# Altium project V2.5.0_ChipSat.PrjPcb
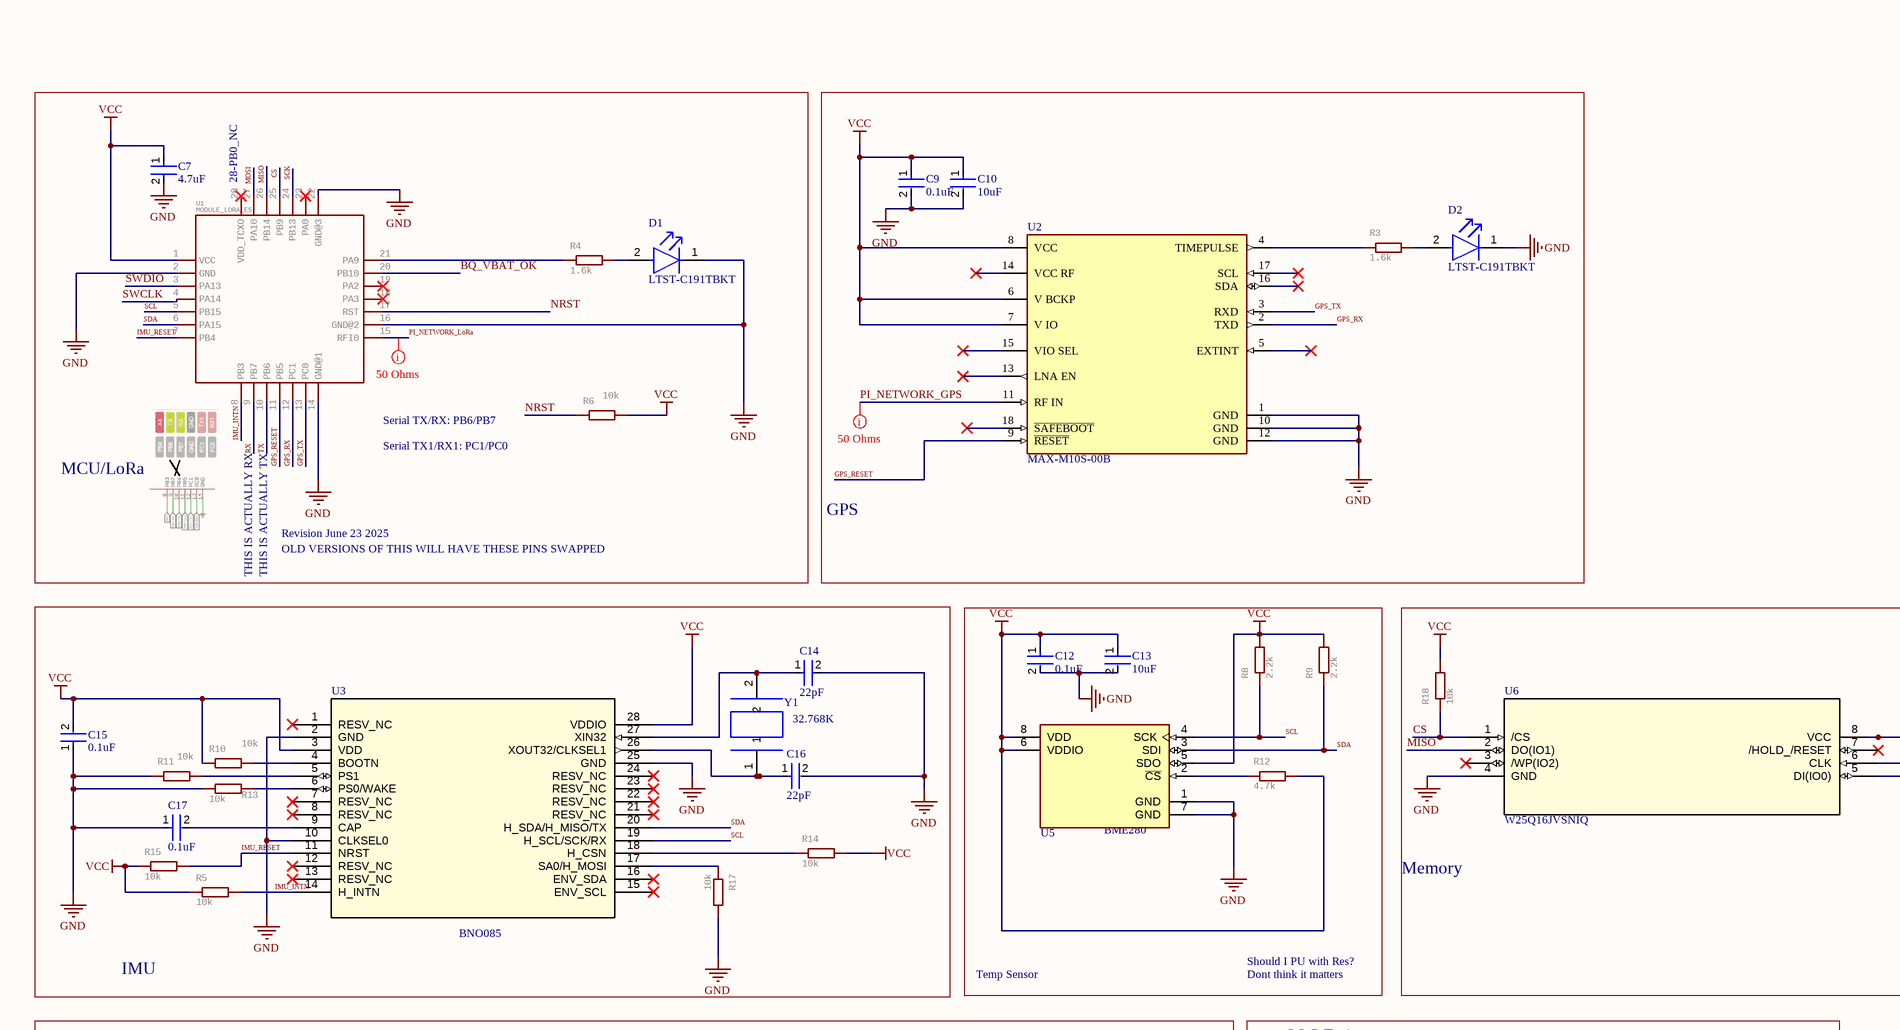
[diagram p0: V2.5.0_ChipSat.SchDoc, top left]
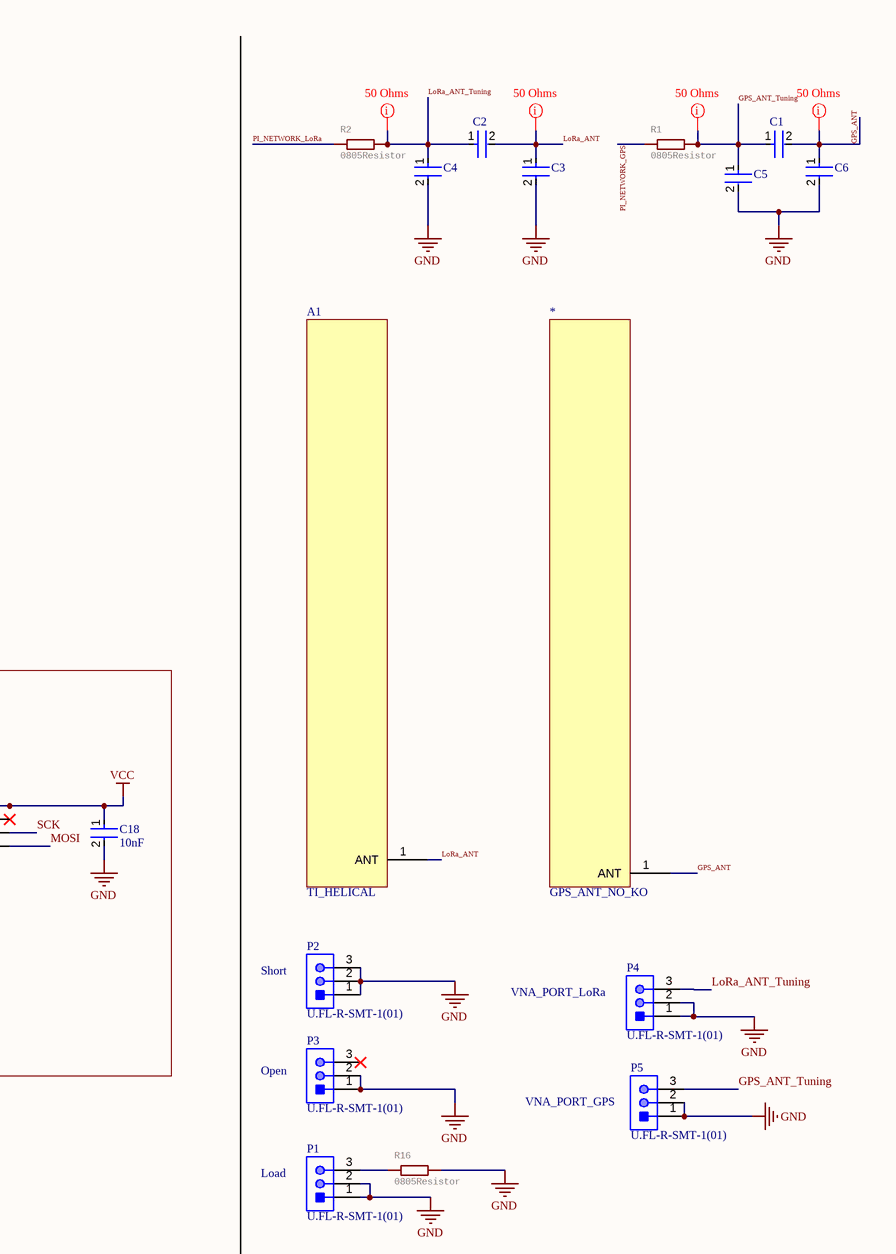
[diagram p1: V2.5.0_ChipSat.SchDoc, top right]
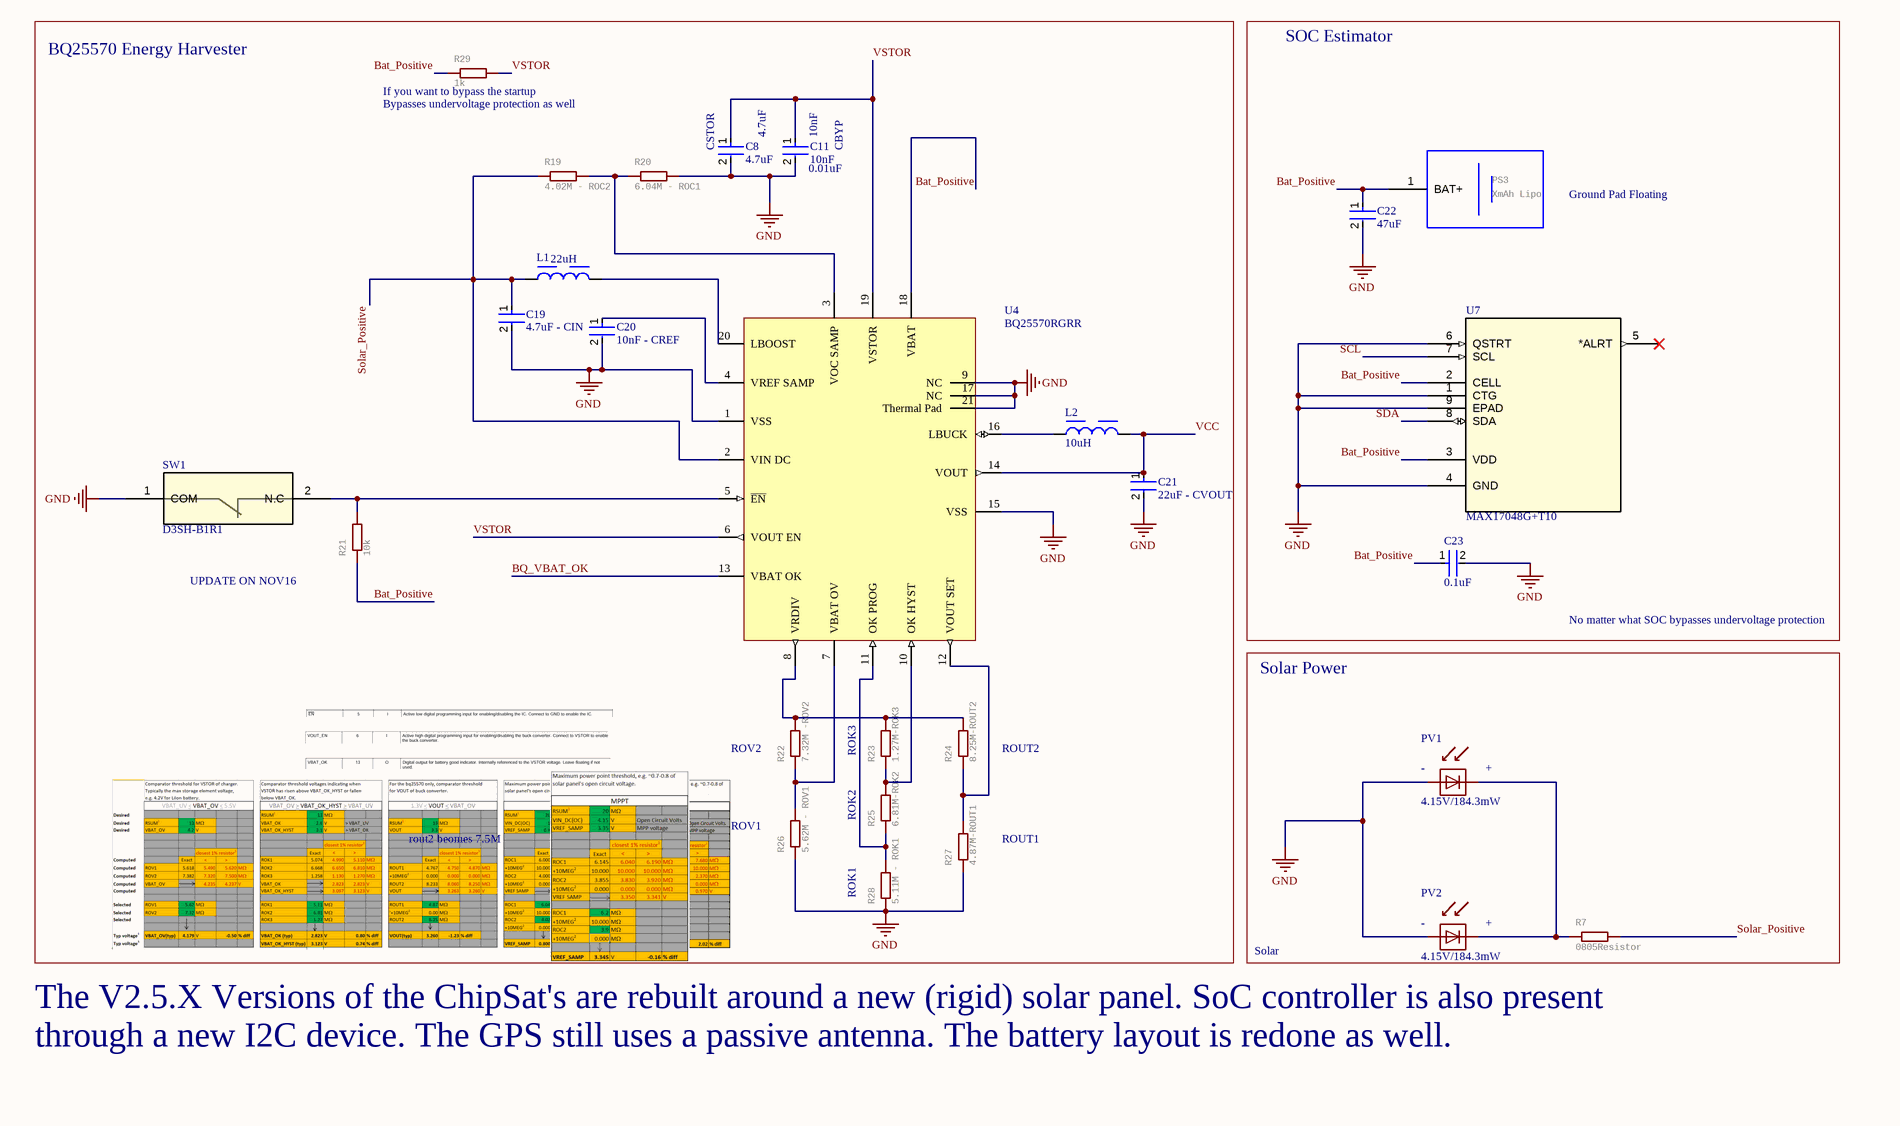
[diagram p2: V2.5.0_ChipSat.SchDoc, bottom left]
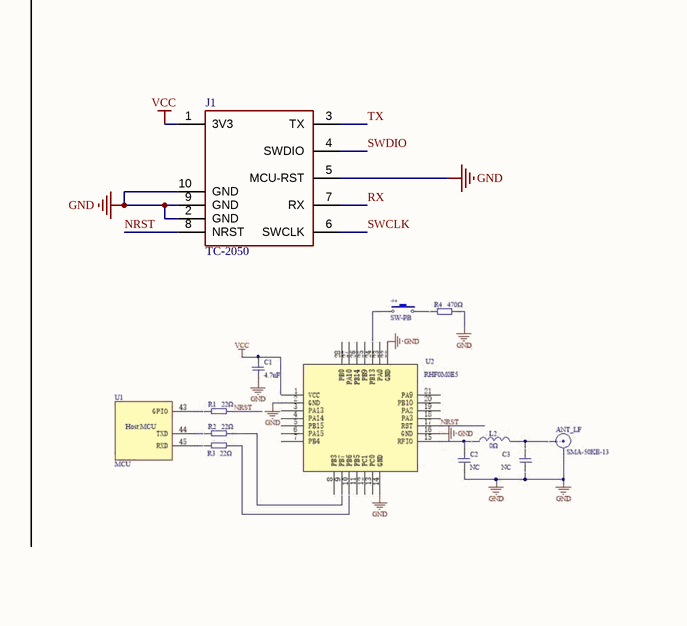
[diagram p3: V2.5.0_ChipSat.SchDoc, bottom right]
1 sheet, 76 parts. Net scope: global (net labels, ports and power ports of the same name join across sheets).
Board file: V2.5.0_ChipSat.PcbDoc

## Sheet V2.5.0_ChipSat.SchDoc
size 558 x 431 mm; SheetNumber: 1; SheetTotal: 1

### Parts
*  GPS_ANT_NO_KO  [GPS_ANT_NO_KO]
A1  TI_HELICAL  [TI_HELICAL]
C1  C0402C223K8PACTU  [PI_NET_CAPACITOR_0805]  (value not drawn)
C2  C0402C223K8PACTU  [PI_NET_CAPACITOR_0805]  (value not drawn)
C3  C0402C223K8PACTU  [PI_NET_CAPACITOR_0805]  (value not drawn)
C4  C0402C223K8PACTU  [PI_NET_CAPACITOR_0805]  (value not drawn)
C5  C0402C223K8PACTU  [PI_NET_CAPACITOR_0805]  (value not drawn)
C6  C0402C223K8PACTU  [PI_NET_CAPACITOR_0805]  (value not drawn)
C7  4.7uF  [0402CAP]
C8  4.7uF  [0402CAP]
C9  0.1uF  [0402CAP]
C10  10uF  [0402CAP]
C11  10nF  [0402CAP]
C12  0.1uF  [0402CAP]
C13  10uF  [0402CAP]
C14  22pF  [0402CAP]
C15  0.1uF  [0402CAP]
C16  22pF  [0402CAP]
C17  0.1uF  [0402CAP]
C18  10nF  [0402CAP]
C19  4.7uF - CIN  [0402CAP]
C20  10nF - CREF  [0402CAP]
C21  22uF - CVOUT  [0402CAP]
C22  47uF  [0805Cap]
C23  0.1uF  [0402CAP]
D1  LTST-C191TBKT  [0805LED]
D2  LTST-C191TBKT  [0805LED]
J1  TC-2050  [JTAG_10p_SilkLess]
L1  22uH  [Inductor_Boost_BQ25570]
L2  10uH  [Inductor_Buck_BQ25570]
P1  U.FL-R-SMT-1(01)  [UFL]
P2  U.FL-R-SMT-1(01)  [UFL]
P3  U.FL-R-SMT-1(01)  [UFL]
P4  U.FL-R-SMT-1(01)  [UFL]
P5  U.FL-R-SMT-1(01)  [UFL]
PS3  XmAh Lipo  [Single_Bat_Pad]
PV1  4.15V/184.3mW  [SolarPanel_KXOB141K06TF-TR]
PV2  4.15V/184.3mW  [SolarPanel_KXOB141K06TF-TR]
R1  0805Resistor  [0805Res]
R2  0805Resistor  [0805Res]
R3  1.6k  [0805Res]
R4  1.6k  [0805Res]
R5  10k  [0402]
R6  10k  [0402]
R7  0805Resistor  [0805Res]
R8  2.2k  [0402]
R9  2.2k  [0402]
R10  10k  [0402]
R11  10k  [0402]
R12  4.7k  [0402]
R13  10k  [0402]
R14  10k  [0402]
R15  10k  [0402]
R16  0805Resistor  [0805Res]
R17  10k  [0402]
R18  10k  [0402]
R19  4.02M - ROC2  [0402]
R20  6.04M - ROC1  [0402]
R21  10k  [0402]
R22  7.32M -ROV2  [0402]
R23  1.27M-ROK3  [0402]
R24  8.25M-ROUT2  [0402]
R25  6.81M-ROK2  [0402]
R26  5.62M - ROV1  [0402]
R27  4.87M-ROUT1  [0402]
R28  5.11M - ROK1  [0402]
R29  1k  [0402]
SW1  D3SH-B1R1  [Micro_Trigger_Switch_Long_D3SH-B1R1]
U1  MODULE_LORA_E5  [MODULE28P-1-25-12X12X2-5MM]
U2  MAX-M10S-00B  [GPS_MAX_10]
U3  BNO085  [QFN28_BNO086_CEV]
U4  BQ25570RGRR  [BQ25570_With_Vias]
U5  BME280  [FP-BME280-MFG]  (value not drawn)
U6  W25Q16JVSNIQ  [SOIC_150MIL_WIN]
U7  MAX17048G+T10  [MAX17048G+T10]
Y1  32.768K  [IMU_CLK_XTAL320X150X75]

### Blocks framed on the sheet
MCU/LoRa: C7 D1 R4 R6 U1
GPS: C9 C10 D2 R3 U2
IMU: C14-C17 R5 R10 R11 R13-R15 R17 U3 Y1
Memory: C18 R18 U6
BQ25570 Energy Harvester: C8 C11 C19-C21 L1 L2 R19-R29 SW1 U4
SOC Estimator: C22 C23 PS3 U7
Solar Power: PV1 PV2 R7

### Nets
GND: C3.2 C4.2 C5.2 C6.2 C7.2 C8.2 C9.2 C10.2 C11.2 C12.2 C13.2 C14.2 C15.1 C16.2 C17.1 C18.2 C19.2 C20.2 C21.2 C22.2 C23.2 D1.1(C) D2.1(C) J1.2(GND) J1.5(MCU-RST) J1.9(GND) J1.10(GND) P1.1 P1.2 P2.1 P2.2 P2.3 P3.1 P3.2 P4.1 P4.2 P5.1 P5.2 PV1.2(-) PV2.2(-) R11.1 R13.1 R16.2 R17.2 R20.2 R26.1 R27.1 R28.1 SW1.1(COM) U1.2(GND) U1.14(GND@1) U1.16(GND@2) U1.22(GND@3) U2.1(GND) U2.10(GND) U2.12(GND) U3.2(GND) U3.10(CLKSEL0) U3.25(GND) U4.1(VSS) U4.9(NC) U4.15(VSS) U4.17(NC) U4.21(Thermal_Pad) U5.1(GND) U5.7(GND) U6.4(GND) U7.1(CTG) U7.4(GND) U7.6(QSTRT) U7.9(EPAD)
VCC: C7.1 C9.1 C10.1 C12.1 C13.1 C15.2 C18.1 C21.1 J1.1(3V3) L2.2 R5.1 R6.2 R8.2 R9.2 R10.1 R12.2 R14.2 R15.1 R18.2 U1.1(VCC) U2.6(V_BCKP) U2.7(V_IO) U2.8(VCC) U3.3(VDD) U3.28(VDDIO) U4.14(VOUT) U5.5(SDO) U5.6(VDDIO) U5.8(VDD) U6.8(VCC)
Bat_Positive: C22.1 C23.1 PS3.1(BAT+) R21.1 R29.1 U4.18(VBAT) U7.2(CELL) U7.3(VDD)
BQ_VBAT_OK: U1.20(PB10) U4.13(VBAT_OK)
CS: R18.1 U1.25(PB9) U6.1(/CS)
GPS_ANT: *.1(ANT) C1.2 C6.1
GPS_ANT_Tuning: C1.1 C5.1 P5.3 R1.2
GPS_RESET: U1.11(PB5) U2.9(~{RESET})
GPS_RX: U1.12(PC1) U2.2(TXD)
GPS_TX: U1.13(PC0) U2.3(RXD)
IMU_INTN: R5.2 U1.8(PB3) U3.14(H_INTN)
IMU_RESET: R15.2 U1.7(PB4) U3.11(NRST)
LoRa_ANT: A1.1(ANT) C2.2 C3.1
LoRa_ANT_Tuning: C2.1 C4.1 P4.3 R2.2
MISO: U1.26(PB14) U6.2(DO(IO1))
MOSI: U1.27(PA10) U6.5(DI(IO0))
NRST: J1.8(NRST) R6.1 U1.17(RST)
PI_NETWORK_GPS: R1.1 U2.11(RF_IN)
PI_NETWORK_LoRa: R2.1 U1.15(RFI0)
RX: J1.7(RX) U1.9(PB7)
SCK: U1.24(PB13) U6.6(CLK)
SCL: R8.1 U1.5(PB15) U3.19(H_SCL/SCK/RX) U5.4(SCK) U7.7(SCL)
SDA: R9.1 U1.6(PA15) U3.20(H_SDA/H_MISO/TX) U5.3(SDI) U7.8(SDA)
Solar_Positive: C19.1 L1.1 R7.2 R19.1 U4.2(VIN_DC)
SWCLK: J1.6(SWCLK) U1.4(PA14)
SWDIO: J1.4(SWDIO) U1.3(PA13)
TX: J1.3(TX) U1.10(PB6)
VSTOR: C8.1 C11.1 R29.2 U4.6(VOUT_EN) U4.19(VSTOR)
NetC14_1: C14.1 U3.27(XIN32) Y1.2
NetC16_1: C16.1 U3.26(XOUT32/CLKSEL1) Y1.1
NetC17_2: C17.2 U3.9(CAP)
NetC20_1: C20.1 U4.4(VREF_SAMP)
NetD1_2: D1.2(A) R4.2
NetD2_2: D2.2(A) R3.2
NetL1_2: L1.2 U4.20(LBOOST)
NetL2_1: L2.1 U4.16(LBUCK)
NetP1_3: P1.3 R16.1
NetPV1_1: PV1.1(+) PV2.1(+) R7.1
NetR3_1: R3.1 U2.4(TIMEPULSE)
NetR4_1: R4.1 U1.21(PA9)
NetR10_2: R10.2 U3.4(BOOTN)
NetR11_2: R11.2 U3.5(PS1)
NetR12_1: R12.1 U5.2(~{CS})
NetR13_2: R13.2 U3.6(PS0/WAKE)
NetR14_1: R14.1 U3.18(H_CSN)
NetR17_1: R17.1 U3.17(SA0/H_MOSI)
NetR19_2: R19.2 R20.1 U4.3(VOC_SAMP)
NetR21_2: R21.2 SW1.2(N.C) U4.5(~{EN})
NetR22_1: R22.1 R26.2 U4.7(VBAT_OV)
NetR22_2: R22.2 R23.2 R24.2 U4.8(VRDIV)
NetR23_1: R23.1 R25.2 U4.10(OK_HYST)
NetR24_1: R24.1 R27.2 U4.12(VOUT_SET)
NetR25_1: R25.1 R28.2 U4.11(OK_PROG)

Not connected (* = marked no-connect by the designer): P3 3*; U1 18(PA3)* 19(PA2)* 23(PA0)* 28(VDD_TCXO)*; U2 5(EXTINT)* 13(LNA_EN)* 14(VCC_RF)* 15(VIO_SEL)* 16(SDA)* 17(SCL)* 18(~{SAFEBOOT})*; U3 1(RESV_NC)* 7(RESV_NC)* 8(RESV_NC)* 12(RESV_NC)* 13(RESV_NC)* 15(ENV_SCL)* 16(ENV_SDA)* 21(RESV_NC)* 22(RESV_NC)* 23(RESV_NC)* 24(RESV_NC)*; U6 3(/WP(IO2))* 7(/HOLD_/RESET)*; U7 5(*ALRT)*

### Layout directives
rule Impedance Constraint [Min = 49.00    Max = 51.00    ]: GPS_ANT, GPS_ANT_Tuning, LoRa_ANT, LoRa_ANT_Tuning, PI_NETWORK_GPS, PI_NETWORK_LoRa

### Notes on the sheet
- (near U1) 28-PB0_NC
- (near U1) Serial TX/RX: PB6/PB7
- Serial TX1/RX1: PC1/PC0
- OLD VERSIONS OF THIS WILL HAVE THESE PINS SWAPPED
- Revision June 23 2025
- THIS IS ACTUALLY RX
- THIS IS ACTUALLY TX
- (near U5) BME280
- (near P2) Short
- VNA_PORT_LoRa
- Temp Sensor
- Should I PU with Res?
- Dont think it matters
- (near P3) Open
- VNA_PORT_GPS
- (near R29) If you want to bypass the startup
- (near R29) Bypasses undervoltage protection as well
- (near C8) CSTOR
- 4.7uF
- (near C11) 10nF
- (near C11) CBYP
- (near P1) Load
- (near C11) 0.01uF
- Ground Pad Floating
- UPDATE ON NOV16
- No matter what SOC bypasses undervoltage protection
- (near R22) ROV2
- (near R23) ROK3
- (near R24) ROUT2
- rout2 beomes 7.5M
- (near R26) ROV1
- (near R25) ROK2
- (near R27) ROUT1
- (near R28) ROK1
- Solar
- The V2.5.X Versions of the ChipSat's are rebuilt around a new (rigid) solar panel. SoC controller is also present through a new I2C device. The GPS still uses a passive antenna. The battery layout is redone as well.
- DWG. NO.
- REV.
- SHT.
- REVISION
- DESCRIPTION
- DATE
- APPROVED
- THIS DOCUMENT AND THE DATA DISCLOSED HEREIN OR HEREWITH IS THE PROPERTY OF ALTIUM LIMITED AND MAY BE FREELY DISTRIBUTED IN WHOLE. NO RIGHTS ARE RESERVED OR EXPRESS OR IMPLIED WARANTEE GIVEN.
- ENG:
- DSN:
- APPROVALS
- PROJECT
- DOCUMENT REVISION:
- DESIGN ITEM:
- CHK:
- BOM:
- REFERENCE DOCUMENTS
- PROJECT REVISION:
- TITLE
- FAB DWG:
- PCB DWG:
- ASSY DWG:
- SCALE:
- SIZE
- C
- CAGE CODE
- FILE NAME
- DWG NO.
- SHEET
- OF
- REV

### Library data of the parts
* = GPS_ANT_NO_KO: helical_antenna schematic for the DeSCENT v1 ChipSat
A1 = TI_HELICAL: helical_antenna schematic for the DeSCENT v1 ChipSat
C1-C6 = 0805RFCapacitor_NO_SILK: CAP0805; Manufacturer: Kemet; Capacitance: 22,000 pF; Value: 22,000 pF; Temperature Coefficient: 15%; Material: Ceramic; Voltage Rating: 10 V; Temperature Characteristic: X5R; Tolerance: 0.1; RoHS: TRUE; Octopart: https://octopart.com/c0402c223k8pactu-kemet-140074; Category: Cap; Manufacturer Part Number: C0402C223K8PACTU; Lead Free: Yes; Automotive: No; Height: 0.55mm; Ipc Land Pattern Name: CAPC10050X50; ComponentLink2URL: https://content.kemet.com/datasheets/KEM_C1002_X7R_SMD.pdf; Device Class L2: Capacitors; Temperature Range Low: -55°C; ComponentLink2Description: Datasheet; Mouser Description: Multilayer Ceramic Capacitors MLCC - SMD/SMT 10volts 22000pF X5R 10%; Device Class L3: Ceramic Capacitors; Package: C0402-BB; Digikey Description: CAP CER 0.022UF 10V X5R 0402; Temperature: -55°C to +125°C; Device Class L1: Passive Components; Temperature Range High: +125°C
C7-C20 = 0402Capacitor: Manufacturer Part Number: C0402C223K8PACTU; Manufacturer: Kemet; Capacitance: 22,000 pF; Value: 22,000 pF; Temperature Coefficient: 15%; Material: Ceramic; Voltage Rating: 10 V; Temperature Characteristic: X5R; Tolerance: 0.1; RoHS: TRUE; Octopart: https://octopart.com/c0402c223k8pactu-kemet-140074; Category: Cap; Lead Free: Yes; Automotive: No; Height: 0.55mm; Ipc Land Pattern Name: CAPC10050X50; ComponentLink2URL: https://content.kemet.com/datasheets/KEM_C1002_X7R_SMD.pdf; Device Class L2: Capacitors; Temperature Range Low: -55°C; ComponentLink2Description: Datasheet; Mouser Description: Multilayer Ceramic Capacitors MLCC - SMD/SMT 10volts 22000pF X5R 10%; Device Class L3: Ceramic Capacitors; Package: C0402-BB; Digikey Description: CAP CER 0.022UF 10V X5R 0402; Temperature: -55°C to +125°C; Device Class L1: Passive Components; Temperature Range High: +125°C
C21 C23 = 0402Capacitor: CVOUT; Manufacturer Part Number: C0402C223K8PACTU; Manufacturer: Kemet; Capacitance: 22,000 pF; Value: 22,000 pF; Temperature Coefficient: 15%; Material: Ceramic; Voltage Rating: 10 V; Temperature Characteristic: X5R; Tolerance: 0.1; RoHS: TRUE; Octopart: https://octopart.com/c0402c223k8pactu-kemet-140074; Category: Cap; Lead Free: Yes; Automotive: No; Height: 0.55mm; Ipc Land Pattern Name: CAPC10050X50; ComponentLink2URL: https://content.kemet.com/datasheets/KEM_C1002_X7R_SMD.pdf; Device Class L2: Capacitors; Temperature Range Low: -55°C; ComponentLink2Description: Datasheet; Mouser Description: Multilayer Ceramic Capacitors MLCC - SMD/SMT 10volts 22000pF X5R 10%; Device Class L3: Ceramic Capacitors; Package: C0402-BB; Digikey Description: CAP CER 0.022UF 10V X5R 0402; Temperature: -55°C to +125°C; Device Class L1: Passive Components; Temperature Range High: +125°C
C22 = 0805Capacitor: CAP CER 0.022UF 10V X5R 0402; Manufacturer Part Number: C0402C223K8PACTU; Manufacturer: Kemet; Capacitance: 22,000 pF; Value: 22,000 pF; Temperature Coefficient: 15%; Material: Ceramic; Tolerance: 0.1; RoHS: TRUE; Octopart: https://octopart.com/c0402c223k8pactu-kemet-140074; Category: Cap; Lead Free: Yes; Automotive: No; Height: 0.55mm; Ipc Land Pattern Name: CAPC10050X50; ComponentLink2URL: https://content.kemet.com/datasheets/KEM_C1002_X7R_SMD.pdf; Device Class L2: Capacitors; Temperature Range Low: -55°C; ComponentLink2Description: Datasheet; Mouser Description: Multilayer Ceramic Capacitors MLCC - SMD/SMT 10volts 22000pF X5R 10%; Voltage Rating: 10 V; Device Class L3: Ceramic Capacitors; Package: C0402-BB; Digikey Description: CAP CER 0.022UF 10V X5R 0402; Temperature Characteristic: X5R; Temperature: -55°C to +125°C; Device Class L1: Passive Components; Temperature Range High: +125°C
D1 D2 = 0805LED: LED BLUE CLEAR CHIP SMD; Lens Color: Colorless; Dominant Wavelength: 475nm; Forward Current: 20mA; Wavelength: 468nm; Viewing Angle: 130°; Power Dissipation: 76mW; Luminous Intensity: 180mcd; Reverse Voltage: 5V; Number of Elements: 1; Lens Style: Diffused; Forward Voltage: 3.8V; Max Power Dissipation: 75mW; Case Code (Metric): 1608; Packaging: Tape and Reel; Case/Package: 0603; Depth: 1.6mm; Mount: Surface Mount; Lead Free: Lead Free; Min Operating Temperature: -20°C; Lens Transparency: Clear; Illumination Color: Blue; Height: 0.55mm; Test Current: 20mA; Case Code (Imperial): 0603; Max Operating Temperature: 80°C; Number of Pins: 2; Length: 0.8mm; Radiation Hardening: No; Package Quantity: 1; Number of LEDs: 1; Width: 0.8mm; Color: Blue
J1 = JTAG_10p_SilkLess: JTAG 10Pos Connector
L1 = Inductor_Boost_BQ25570: 744031220; NexarPartId: 22866169; Series Resistance: 450mΩ; Self Resonant Frequency: 26MHz; Core Material: Ferrite; Current Rating: 510mA; Test Frequency: 100kHz; Tolerance: 30%; Saturation Current: 360mA; Inductance: 22µH; DC Resistance (DCR): 410mΩ; Width: 3.8mm; Ambient Temperature Range High: 95°C; Number of Pins: 2; Ambient Temperature Range Low: -40°C; Min Operating Temperature: -40°C; Packaging: Tape & Reel (TR); Height: 1.65mm; RoHS: Compliant; Composition: Wirewound; RMS Current (Irms): 510mA; Max Operating Temperature: 125°C; Inductance Tolerance: 30%; Length: 3.8mm
L2 = Inductor_Buck_BQ25570: 744029100; NexarPartId: 8917062; Tolerance: 30%; Saturation Current: 500mA; Series Resistance: 300mΩ; Shielding: Shielded; Core Material: Ferrite; Resistance: 390mΩ; Max DC Current: 800mA; Inductance: 10µH; Self Resonant Frequency: 40MHz; Test Frequency: 100kHz; RMS Current (Irms): 650mA; Min Operating Temperature: -40°C; Mount: Surface Mount; Height - Seated (Max): 1.4986mm; Width: 2.78mm; Number of Pins: 2; Ambient Temperature Range High: 85°C; Lead Free: Lead Free; Case/Package: Nonstandard; Weight: 32.006612mg; REACH SVHC: Unknown; Depth: 2.8mm; Height: 1.35mm; Length: 2.78mm; RoHS: Compliant; Max Operating Temperature: 125°C; DC Resistance (DCR): 390mΩ; Inductance Tolerance: 30%; Composition: Wirewound; Current Rating: 650mA; Ambient Temperature Range Low: -40°C; Termination: SMD/SMT; Packaging: Cut Tape (CT)
P1-P5 = UFL: Ultra Small Coaxial Connector, 6 GHz, -40 to 90 degC, 3-Pin SMD, RoHS, Bulk; Manufacturer: Hirose Electric; Connector Style: U.FL; Impedance: 50Ohm; Dielectric Material: LiquidCrystalPolymer(LCP); Minimum Quantity: UltraMiniatureCoaxial; Online Catalog: U.FLSeries; Featured Product: HiroseU.FLSeries; Frequency - Max: 6GHz; Other Names: H122041 / U.FL-R-SMT-1(01)-ND; Contact Termination: Solder; Body Material: PhosphorBronze; Connector Type: Jack,MalePin; Body Finish: Silver; Center Contact Plating: Gold; Manufacturer URL: https://www.hirose.com; Family: CoaxialConnectors(RF); Fastening Type: Snap-On; Unit PriceUSD: U.FL; Series: U.FL; Package Reference: U.FL-R-SMT; Packaging: Bulk; Standard Package: 100; Mounting Type: SurfaceMount; Quantity Available: Bulk; Housing Color: Silver; Package Description: 3-Pin Surface Mount Device, Body 2.6 x 2.6 mm; Category: Connectors,Interconnects; Operating Temperature: -40degC~90degC; Center Contact Material: PhosphorBronze; Dynamic Catalog: U.FLSeries; Datasheet URL: https://datasheet.ciiva.com/26945/getdatasheetpartid-475239-26945414.pdf; Datasheet Version: Feb-09; Shield Termination: Solder
PS3 = Single_BAT_PAD: No SILK; GateName_1: G$1; SymbolName_1: ALTA_CELL; LibraryName: ALTA_CELL; DeviceSetName: ALTA_CELL
PV1 PV2 = SolarPanel_KXOB141K06TF-TR: KXOB141K06TF-TR / https://www.digikey.com/en/products/detail/anysolar-ltd/KXOB141K06TF-TR/13999140?s=N4IgTCBcDaINIA0DyAhAjAFjXADANgBUAxAWgICUAdSkAXQF8g
R1 R2 R7 R16 = 0805Resistor: RESISTOR, European symbol; GateName_1: G$1; SymbolName_1: R-EU; DeviceName: M0805; DeviceSetName: R-EU_; LibraryName: rcl
R3 R4 = 0805Resistor: RF RESISTOR; GateName_1: G$1; SymbolName_1: R-EU; DeviceName: M0805; DeviceSetName: R-EU_; LibraryName: rcl
R5 R6 R8-R15 R17-R29 = 0402Resistor: RESISTOR, European symbol; GateName_1: G$1; SymbolName_1: R-EU; DeviceName: M0805; DeviceSetName: R-EU_; LibraryName: rcl
SW1 = Micro_Trigger_Switch_Long_D3SH-B1R1: Manufacturer_Name: Omron; Copyright: Copyright (C) 2025 Ultra Librarian. All rights reserved.; Manufacturer_Part_Number: D3SH-B1R1; RefDes: RefDes; Type: Type
U1 = MODULE_LORA_E5: GateName_1: G$1; SymbolName_1: MOUDLE_LORA_E5; LibraryName: LORA-E5_Eagle_Library; DeviceSetName: MODULE_LORA_E5; Package: MODULE28P-1.25-12X12X2.5MM
U2 = GPS_MAX_10: GNSS LCC RX, ROM, TCXO, LNA, SAW
U3 = BNO086: No Description Available; Mfr_Name: CEVA; Type: Motion Sensors; RefDes: RefDes
U4 = BQ25570_PIN_ARRANGE: IC ENERGY HARV CTRLR BATT 20VQFN; Operating Supply Current: 488nA; Switching Frequency: 1MHz; Operating Supply Voltage: 4V; Output Current: 100mA; Packaging: Tape and Reel; Lead Free: Lead Free; Contact Plating: Gold; RoHS Compliant: Yes; Mount: Surface Mount; Case/Package: VQFN; Min Operating Temperature: -40°C; Max Operating Temperature: 125°C; Package Quantity: 3000; Number of Pins: 20
U5 = BME280: Temp and huminity sensor
U6 = W25Q16JVSNIQ: No Description Available; Mfr_Name: Winbond; RefDes: RefDes; Type: Type
U7 = MAX17048G+T10: 3ÂµA 1-Cell/2-Cell Fuel Gauge with ModelGauge / https://www.digikey.com/en/products/detail/analog-devices-inc-maxim-integrated/MAX17048G-T10/3758921; Manufacturer_Name: Analog Devices Inc; Copyright: Copyright (C) 2026 Ultra Librarian. All rights reserved.; Manufacturer_Part_Number: MAX17048G+T10; RefDes: RefDes; Type: Type
Y1 = IMU_CLK_9HT10-32.768KBZF-T: 32.768 kHz Â±50ppm Crystal 12.5pF 70 kOhms 2-SMD, No Lead; MF: TXC; SnapEDA_Link: https://www.snapeda.com/parts/9HT10-32.768KBZF-T/TXC/view-part/?ref=snap; Package: SMD-2 TXC Corporation; Value: *; MP: 9HT10-32.768KBZF-T; Check_prices: https://www.snapeda.com/parts/9HT10-32.768KBZF-T/TXC/view-part/?ref=eda